# EAGLE board BlockBox v2 (EAGLE 9.5.2), part 1 of 2
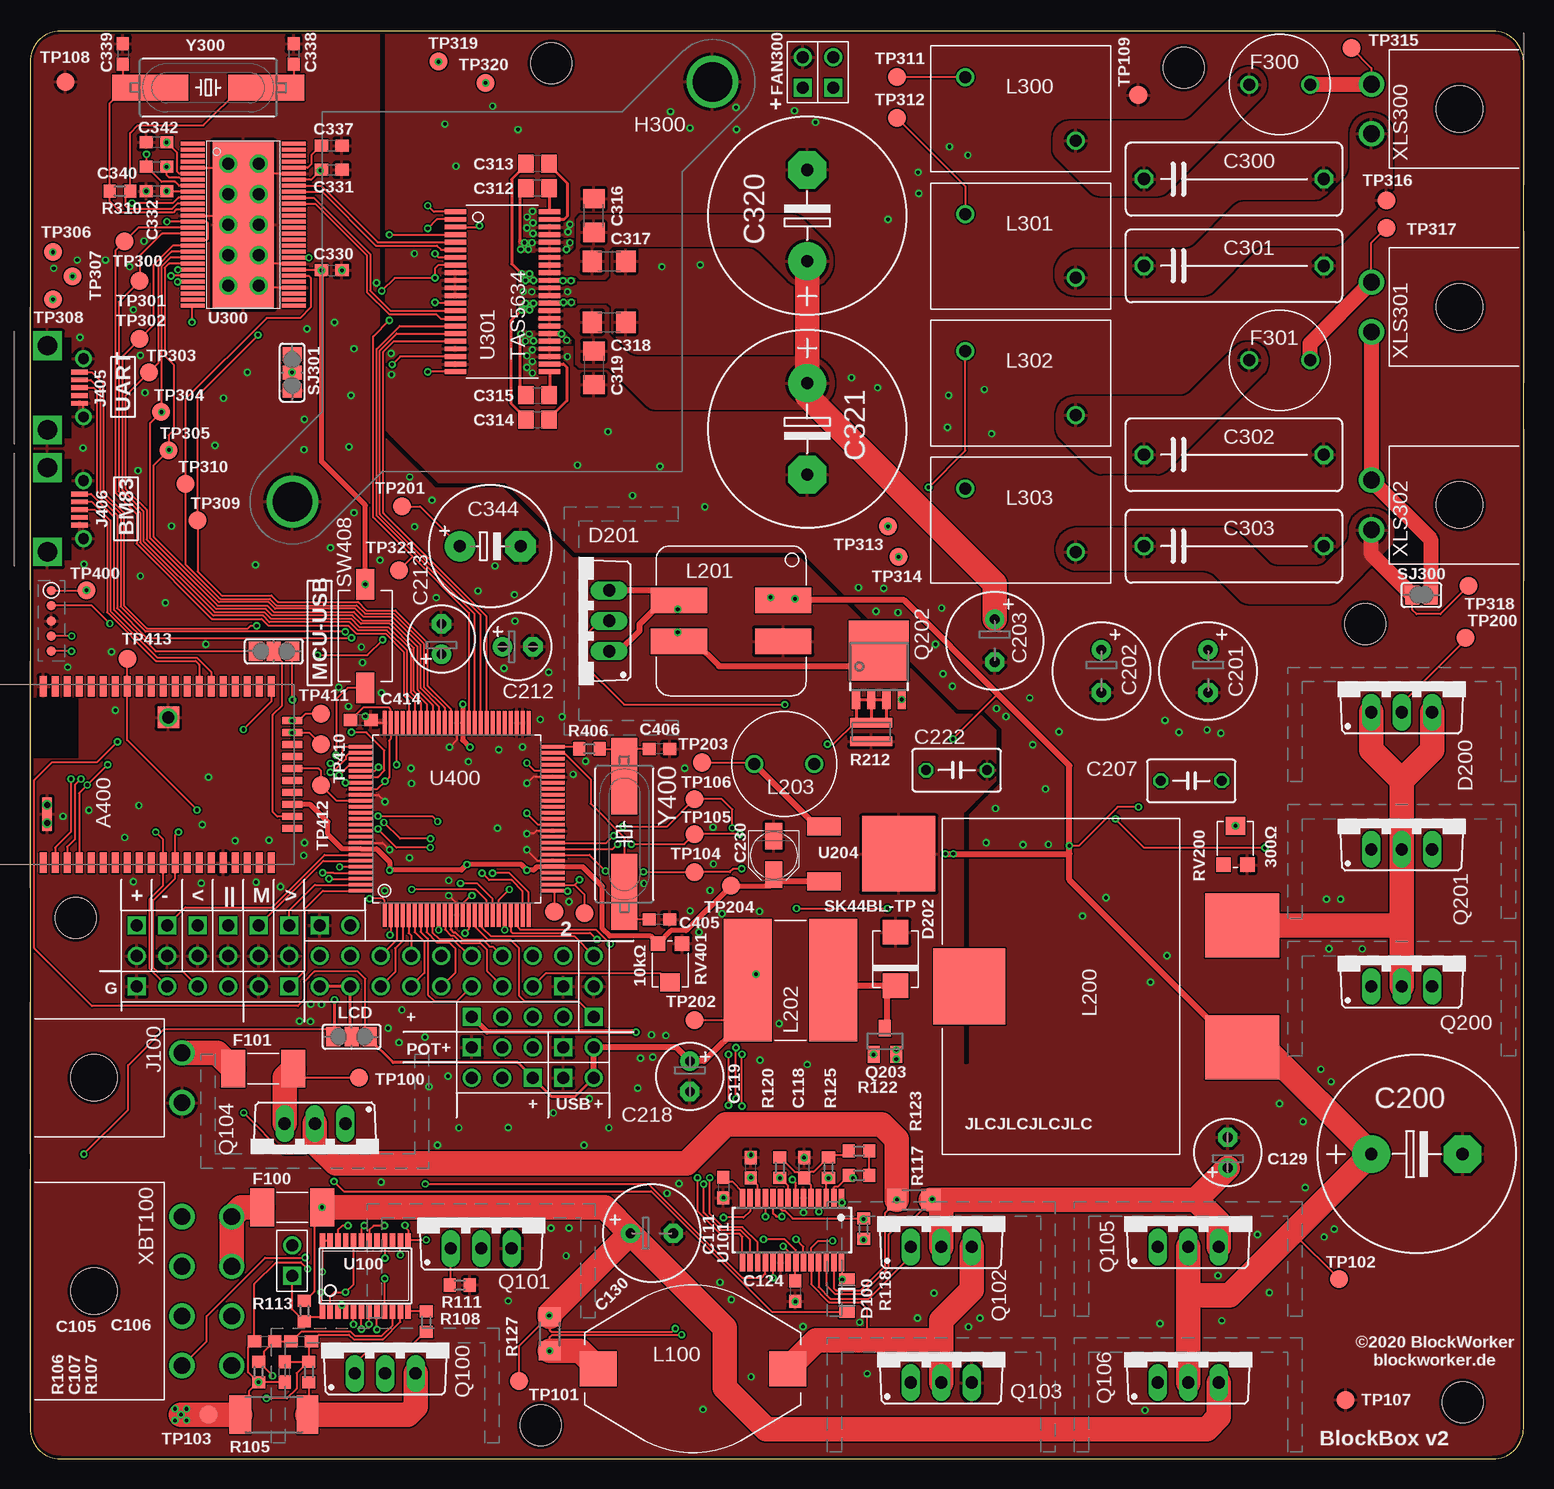
[diagram p4: board, top side]
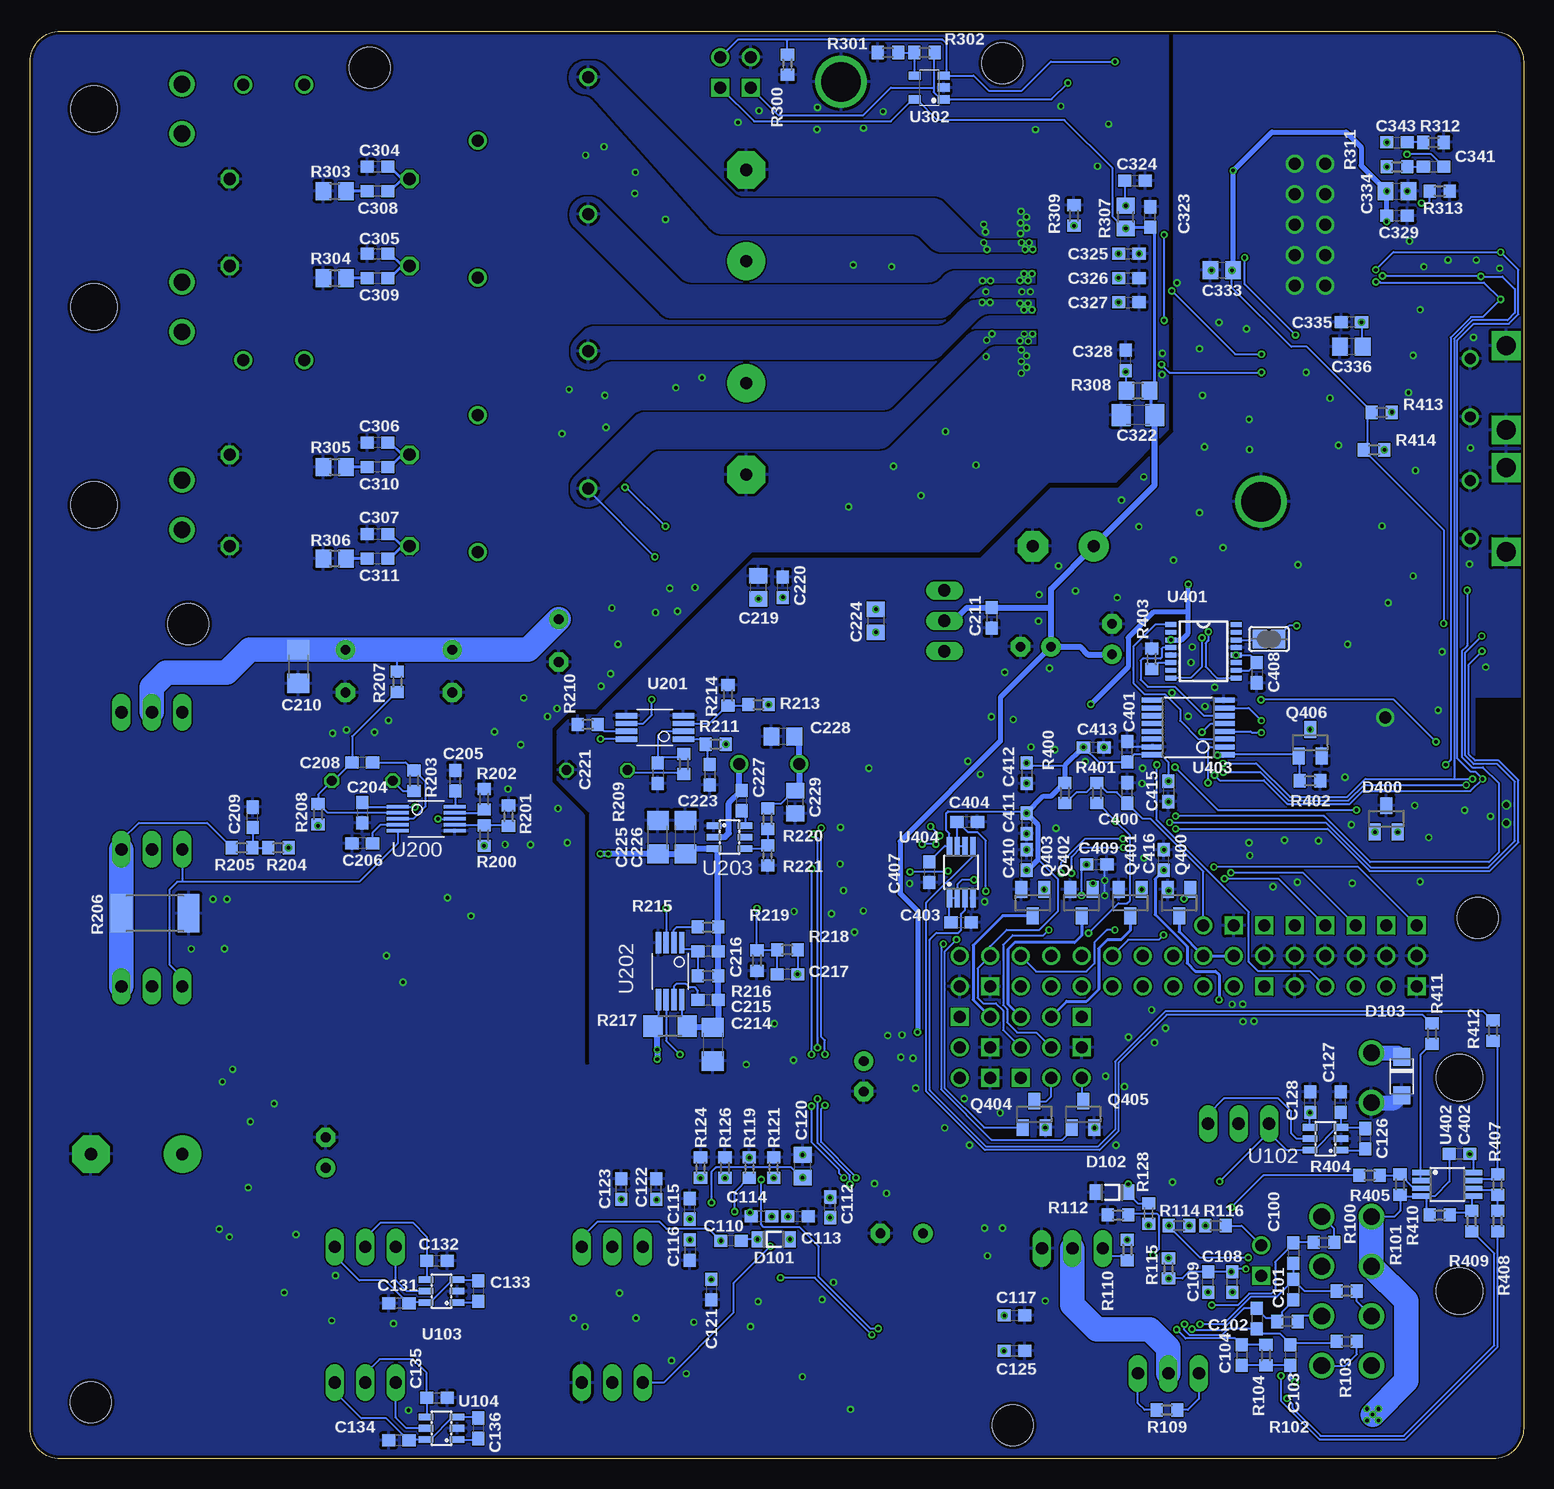
[diagram p5: board, bottom side, seen from below]

Size 124.46 x 119 mm. Coordinates in mm from the lower left corner, seen from the top.
Outline: 121.92,119 2.54,119 arc90 0,116.46 0,2.54 arc90 2.54,0 121.92,0 arc90 124.46,2.54 124.46,116.46 arc90 121.92,119
Copper layers (1*16): Top 0.035mm / dielectric 1.5mm / Bottom 0.035mm
Design rules "jlcpcb-2l": minimum track width 5mil, minimum drill 0.3mm, track to track 5mil, track to pad 5mil, pad to pad 5mil, via to via 5mil, smd to smd 0mil, copper to edge 0.25mm, drill to drill 6mil, minimum pad ring 6mil, minimum via ring 6mil, stop-mask expansion 4mil, vias tented up to drill 0.3mm, thermal gap 10mil
Holes 3.4 mm at 42.55,2.79 3.81,45.09 43.43,116.33 119.38,4.7 111.25,69.6 96.14,115.95

## Footprints (pad centres in the part's own frame; a part is rotated, then mirrored left to right if it is on the bottom)
BM83 = smd 1.7 x 0.6: 1 0.15,-1.1; 2 0.15,-2.1; 3 0.15,-3.1; 4 0.15,-4.1; 5 0.15,-5.1; 6 0.15,-6.1; 7 0.15,-7.1; 8 0.15,-8.1; 9 0.15,-9.1; 10 0.15,-10.1; 11 0.15,-11.1; 12 0.15,-12.1; 13 0.15,-13.1; 14 0.15,-14.1; 15 0.15,-15.1; 16 0.15,-16.1; 17 0.15,-17.1; 18 0.15,-18.1; 19 0.15,-19.1; 20 0.15,-20.1; 31 14.85,-20.1; 32 14.85,-19.1; 33 14.85,-18.1; 34 14.85,-17.1; 35 14.85,-16.1; 36 14.85,-15.1; 37 14.85,-14.1; 38 14.85,-13.1; 39 14.85,-12.1; 40 14.85,-11.1; 41 14.85,-10.1; 42 14.85,-9.1; 43 14.85,-8.1; 44 14.85,-7.1; 45 14.85,-6.1; 46 14.85,-5.1; 47 14.85,-4.1; 48 14.85,-3.1; 49 14.85,-2.1; 50 14.85,-1.1 | smd 0.6 x 1.7: 21 3,-21.85; 22 4,-21.85; 23 5,-21.85; 24 6,-21.85; 25 7,-21.85; 26 8,-21.85; 27 9,-21.85; 28 10,-21.85; 29 11,-21.85; 30 12,-21.85 | smd 2.79 x 0.76: G1 4.21,-1.42 | smd 1.78 x 1.78: G2 12.27,-11.53
C0603 = smd 1.1 x 1: 1 -0.85,0; 2 0.85,0
C0805 = smd 1.3 x 1.5: 1 -0.95,0; 2 0.95,0
E2,5-6 = drill 0.813 pad 1.6: + -1.27,0 | drill 0.813 pad 1.6 octagon: - 1.27,0
E3,5-8 = drill 0.813 pad 1.6: + -1.778,0 | drill 0.813 pad 1.6 octagon: - 1.778,0
E7,5-16 = drill 1.016 pad 3.15: + -3.81,0 | drill 1.016 pad 3.15 octagon: - 3.81,0
C050-035X075 = drill 0.813 octagon: 1 -2.54,0; 2 2.54,0
C1206 = smd 1.6 x 1.8: 1 -1.4,0; 2 1.4,0
PANASONIC_B = smd 2.2 x 1.4: + 1.6,0; - -1.6,0
C150-064X183 = drill 1.016 octagon: 1 -7.493,0; 2 7.493,0
E5-10,5 = drill 1.016 pad 2.54: + -2.54,0 | drill 1.016 pad 2.54 octagon: - 2.54,0
SOD323 = smd 1 x 1.3: 1 -1.35,0; 2 1.35,0
DO-219AB = smd 1.5 x 1.4: A -1.6,0; K 1.6,0
TO220ABS-HS1 = drill 1.016 long: A1 -2.54,-2.54; A2 2.54,-2.54; C 0,-2.54
DO-214AA = smd 2.032 x 2.108: A -2.235,0; K 2.235,0
SOT23 = smd 1 x 1.4: 1 -0.95,-1.1; 2 0.95,-1.1; 3 0,1.1
F2410 = smd 2 x 3.15: 1 -2.5,0; 2 2.5,0
MRF_FUSE = drill 1: 1 -2.54,0; 2 2.54,0
WIRE-2P-SIMPLE = drill 1 square: 1 -1.27,0 | drill 1: 2 1.27,0
ATS-CPX030030030-173-C2-R0 = drill 3.3: H1 17.5,17.5; H2 -17.5,-17.5
TE-770966 = drill 1.4: 1 -2.07,12.67; 2 2.07,12.67 | hole 3.86: 0,5.33
5P-1.27-POGO = smd 0.8 x 0.8: 1 -2.54,0; 2 -1.27,0; 3 0,0; 4 1.27,0; 5 2.54,0
4PIN = drill 1 square: 1 -3.81,0 | drill 1: 2 -1.27,0; 3 1.27,0; 4 3.81,0
3PIN = drill 1 square: 1 -2.54,0 | drill 1: 2 0,0; 3 2.54,0
2PIN = drill 1 square: 1 -1.27,0 | drill 1: 2 1.27,0
ZX62D-B-5PA8 = smd 0.4 x 1.35: 1 3.4,4.125; 2 4.05,4.125; 3 4.7,4.125; 4 5.35,4.125; 5 6,4.125 | drill 1.6 pad 2.375 square: S1 1.188,1.45; S2 8.213,1.45 | drill 0.9 pad 1.4: S3 2.275,4.45; S4 7.125,4.45
PM5022 = smd 3.1 x 2.9: 1 -7.9,0; 2 7.9,0
PQ2614B = smd 5.33 x 6.2: 1 -5.075,-14.66; 2 5.075,-14.66 | smd 6.35 x 6: M 0,8.08
SRF1280A = smd 2.15 x 4.7: 1 -1.715,4.35; 2 1.715,4.35; 3 1.715,-4.35; 4 -1.715,-4.35
SRN1060 = smd 4 x 10.2: 1 -3.55,0; 2 3.55,0
RLB0912 = drill 1: 1 -2.5,0; 2 2.5,0
1D14A = drill 1: 1 -4.6,2.65; 2 4.6,-2.65
TO220BV-HS1 = drill 1.016 long: D 0,-2.54; G -2.54,-2.54; S 2.54,-2.54
SOT669 = smd 0.7 x 1.6: 1 -1.905,-2.75; 2 -0.635,-2.75; 3 0.635,-2.75; 4 1.905,-2.75 | smd 5 x 5: MB 0,1.35
R0603 = smd 1 x 1.1: 1 -0.85,0; 2 0.85,0
R2512 = smd 1.8 x 3.2: 1 -2.8,0; 2 2.8,0
R1206 = smd 1.6 x 1.803: 1 -1.422,0; 2 1.422,0
R0612 = smd 0.8 x 3.5: 1 -0.78,0; 2 0.78,0
R0805 = smd 1.3 x 1.5: 1 -0.95,0; 2 0.95,0
TC33X-2 = smd 1.2 x 1.2: 1 -1,-1.8; 3 1,-1.8 | smd 1.6 x 1.5: 2 0,1.45
WIRE-3P-SIMPLE = drill 1 square: 1 -2.54,0 | drill 1: 2 0,0; 3 2.54,0
SJ = smd 1.168 x 1.6: 1 -0.762,0; 2 0.762,0
SJ_2 = smd 1.168 x 1.6: 1 -1.524,0; 2 0,0; 3 1.524,0
SDA01H1S = smd 1.524 x 2.54: 1 0,-4.318; 2 0,4.318
TP15R = smd 1.5 x 1.5: TP 0,0
TSSOP24 = smd 0.45 x 1.3: 1 -3.575,-2.918; 2 -2.925,-2.918; 3 -2.275,-2.918; 4 -1.625,-2.918; 5 -0.975,-2.918; 6 -0.325,-2.918; 7 0.325,-2.918; 8 0.975,-2.918; 9 1.625,-2.918; 10 2.275,-2.918; 11 2.925,-2.918; 12 3.575,-2.918; 13 3.575,2.918; 14 2.925,2.918; 15 2.275,2.918; 16 1.625,2.918; 17 0.975,2.918; 18 0.325,2.918; 19 -0.325,2.918; 20 -0.975,2.918; 21 -1.625,2.918; 22 -2.275,2.918; 23 -2.925,2.918; 24 -3.575,2.918
QSOP28 = smd 0.45 x 1.5: 1 -4.128,-2.69; 2 -3.493,-2.69; 3 -2.857,-2.69; 4 -2.223,-2.69; 5 -1.587,-2.69; 6 -0.953,-2.69; 7 -0.318,-2.69; 8 0.318,-2.69; 9 0.953,-2.69; 10 1.587,-2.69; 11 2.223,-2.69; 12 2.857,-2.69; 13 3.493,-2.69; 14 4.128,-2.69; 15 4.128,2.69; 16 3.493,2.69; 17 2.857,2.69; 18 2.223,2.69; 19 1.587,2.69; 20 0.953,2.69; 21 0.318,2.69; 22 -0.318,2.69; 23 -0.953,2.69; 24 -1.587,2.69; 25 -2.223,2.69; 26 -2.857,2.69; 27 -3.493,2.69; 28 -4.128,2.69
SOT23-6L = smd 0.55 x 1.2: 1 -0.95,-1.3; 2 0,-1.3; 3 0.95,-1.3; 4 0.95,1.3; 5 0,1.3; 6 -0.95,1.3
VSSOP10 = smd 1.8 x 0.3: 1 -2.375,1; 2 -2.375,0.5; 3 -2.375,0; 4 -2.375,-0.5; 5 -2.375,-1; 6 2.375,-1; 7 2.375,-0.5; 8 2.375,0; 9 2.375,0.5; 10 2.375,1
VSSOP8 = smd 1.8 x 0.45: 1 -2.375,0.975; 2 -2.375,0.325; 3 -2.375,-0.325; 4 -2.375,-0.975; 5 2.375,-0.975; 6 2.375,-0.325; 7 2.375,0.325; 8 2.375,0.975
DPAK = smd 1.5 x 2.8: 1 -2.286,-3.95; 3 2.286,-3.95 | smd 6.3 x 6.1: TAB 0,2.3
HTSSOP56DCA = smd 0.3 x 2: 1 -6.75,-4.2; 2 -6.25,-4.2; 3 -5.75,-4.2; 4 -5.25,-4.2; 5 -4.75,-4.2; 6 -4.25,-4.2; 7 -3.75,-4.2; 8 -3.25,-4.2; 9 -2.75,-4.2; 10 -2.25,-4.2; 11 -1.75,-4.2; 12 -1.25,-4.2; 13 -0.75,-4.2; 14 -0.25,-4.2; 15 0.25,-4.2; 16 0.75,-4.2; 17 1.25,-4.2; 18 1.75,-4.2; 19 2.25,-4.2; 20 2.75,-4.2; 21 3.25,-4.2; 22 3.75,-4.2; 23 4.25,-4.2; 24 4.75,-4.2; 25 5.25,-4.2; 26 5.75,-4.2; 27 6.25,-4.2; 28 6.75,-4.2; 29 6.75,4.2; 30 6.25,4.2; 31 5.75,4.2; 32 5.25,4.2; 33 4.75,4.2; 34 4.25,4.2; 35 3.75,4.2; 36 3.25,4.2; 37 2.75,4.2; 38 2.25,4.2; 39 1.75,4.2; 40 1.25,4.2; 41 0.75,4.2; 42 0.25,4.2; 43 -0.25,4.2; 44 -0.75,4.2; 45 -1.25,4.2; 46 -1.75,4.2; 47 -2.25,4.2; 48 -2.75,4.2; 49 -3.25,4.2; 50 -3.75,4.2; 51 -4.25,4.2; 52 -4.75,4.2; 53 -5.25,4.2; 54 -5.75,4.2; 55 -6.25,4.2; 56 -6.75,4.2 | smd 14 x 5.1: EXP 0,0
TSSOP44 = smd 1.8 x 0.4: 1 -3.925,6.668; 2 -3.925,6.032; 3 -3.925,5.397; 4 -3.925,4.763; 5 -3.925,4.128; 6 -3.925,3.493; 7 -3.925,2.857; 8 -3.925,2.223; 9 -3.925,1.587; 10 -3.925,0.953; 11 -3.925,0.318; 12 -3.925,-0.318; 13 -3.925,-0.953; 14 -3.925,-1.587; 15 -3.925,-2.223; 16 -3.925,-2.857; 17 -3.925,-3.493; 18 -3.925,-4.128; 19 -3.925,-4.763; 20 -3.925,-5.397; 21 -3.925,-6.032; 22 -3.925,-6.668; 23 3.925,-6.668; 24 3.925,-6.032; 25 3.925,-5.397; 26 3.925,-4.763; 27 3.925,-4.128; 28 3.925,-3.493; 29 3.925,-2.857; 30 3.925,-2.223; 31 3.925,-1.587; 32 3.925,-0.953; 33 3.925,-0.318; 34 3.925,0.318; 35 3.925,0.953; 36 3.925,1.587; 37 3.925,2.223; 38 3.925,2.857; 39 3.925,3.493; 40 3.925,4.128; 41 3.925,4.763; 42 3.925,5.397; 43 3.925,6.032; 44 3.925,6.668
TSOP-5 = smd 0.7 x 1: 1 -0.99,-1.2; 2 0,-1.2; 3 0.99,-1.2; 4 0.99,1.2; 5 -0.99,1.2
TQFP100-14X14X1MM = smd 2 x 0.3: 1 -8,6; 2 -8,5.5; 3 -8,5; 4 -8,4.5; 5 -8,4; 6 -8,3.5; 7 -8,3; 8 -8,2.5; 9 -8,2; 10 -8,1.5; 11 -8,1; 12 -8,0.5; 13 -8,0; 14 -8,-0.5; 15 -8,-1; 16 -8,-1.5; 17 -8,-2; 18 -8,-2.5; 19 -8,-3; 20 -8,-3.5; 21 -8,-4; 22 -8,-4.5; 23 -8,-5; 24 -8,-5.5; 25 -8,-6; 51 8,-6; 52 8,-5.5; 53 8,-5; 54 8,-4.5; 55 8,-4; 56 8,-3.5; 57 8,-3; 58 8,-2.5; 59 8,-2; 60 8,-1.5; 61 8,-1; 62 8,-0.5; 63 8,0; 64 8,0.5; 65 8,1; 66 8,1.5; 67 8,2; 68 8,2.5; 69 8,3; 70 8,3.5; 71 8,4; 72 8,4.5; 73 8,5; 74 8,5.5; 75 8,6 | smd 0.3 x 2: 26 -6,-8; 27 -5.5,-8; 28 -5,-8; 29 -4.5,-8; 30 -4,-8; 31 -3.5,-8; 32 -3,-8; 33 -2.5,-8; 34 -2,-8; 35 -1.5,-8; 36 -1,-8; 37 -0.5,-8; 38 0,-8; 39 0.5,-8; 40 1,-8; 41 1.5,-8; 42 2,-8; 43 2.5,-8; 44 3,-8; 45 3.5,-8; 46 4,-8; 47 4.5,-8; 48 5,-8; 49 5.5,-8; 50 6,-8; 76 6,8; 77 5.5,8; 78 5,8; 79 4.5,8; 80 4,8; 81 3.5,8; 82 3,8; 83 2.5,8; 84 2,8; 85 1.5,8; 86 1,8; 87 0.5,8; 88 0,8; 89 -0.5,8; 90 -1,8; 91 -1.5,8; 92 -2,8; 93 -2.5,8; 94 -3,8; 95 -3.5,8; 96 -4,8; 97 -4.5,8; 98 -5,8; 99 -5.5,8; 100 -6,8
SSOP16 = smd 0.914 x 0.406: 1 -2.718,2.223; 2 -2.718,1.587; 3 -2.718,0.953; 4 -2.718,0.318; 5 -2.718,-0.318; 6 -2.718,-0.953; 7 -2.718,-1.587; 8 -2.718,-2.223; 9 2.718,-2.223; 10 2.718,-1.587; 11 2.718,-0.953; 12 2.718,-0.318; 13 2.718,0.318; 14 2.718,0.953; 15 2.718,1.587; 16 2.718,2.223
MSOP8 = smd 0.45 x 1.45: 1 -0.975,-2.2; 2 -0.325,-2.2; 3 0.325,-2.2; 4 0.975,-2.2; 5 0.975,2.2; 6 0.325,2.2; 7 -0.325,2.2; 8 -0.975,2.2
TSSOP16L = smd 0.42 x 1.78: 1 -2.275,-2.97; 2 -1.625,-2.97; 3 -0.975,-2.97; 4 -0.325,-2.97; 5 0.325,-2.97; 6 0.975,-2.97; 7 1.625,-2.97; 8 2.275,-2.97; 9 2.275,2.97; 10 1.625,2.97; 11 0.975,2.97; 12 0.325,2.97; 13 -0.325,2.97; 14 -0.975,2.97; 15 -1.625,2.97; 16 -2.275,2.97
TE-770970 = drill 1.4: 1 -6.21,16.81; 2 -2.07,16.81; 3 2.07,16.81; 4 6.21,16.81; 5 -6.21,12.67; 6 -2.07,12.67; 7 2.07,12.67; 8 6.21,12.67 | hole 3.86: 0,5.33
2X9PIN = drill 1 square: 1 -8.89,1.27 | drill 1: 2 -8.89,-1.27; 3 -6.35,1.27; 4 -6.35,-1.27; 5 -3.81,1.27; 6 -3.81,-1.27; 7 -1.27,1.27; 8 -1.27,-1.27; 9 1.27,1.27; 10 1.27,-1.27; 11 3.81,1.27; 12 3.81,-1.27; 13 6.35,1.27; 14 6.35,-1.27; 15 8.89,1.27; 16 8.89,-1.27; 17 11.43,1.27; 18 11.43,-1.27
HC49US = smd 6.35 x 2.159: 1 -4.826,0; 2 4.826,0

## Placement (x,y rotation side)
A400  BM83  [BM83]  0,49.53 90 top
C100  1µF  [C0603]  19.18,17.14 270 bottom
C101  1µF  [C0603]  19.18,14.1 270 bottom
C102  1µF  [C0603]  22.23,11.68 270 bottom
C103  1µF  [C0603]  19.43,8.64 270 bottom
C104  1µF  [C0603]  23.5,8.64 270 bottom
C105  0.1µF  [C0603]  19.56,9.78 0 top
C106  0.1µF  [C0603]  22.61,9.78 0 top
C107  0.1µF  [C0603]  21.21,7.24 90 top
C108  1µF  [C0603]  24.26,14.73 90 bottom
C109  1µF  [C0603]  26.29,14.73 90 bottom
C110  0.1µF  [C0603]  66.04,18.16 180 bottom
C111  4.7nF  [C0603]  57.78,22.61 270 top
C112  4.7nF  [C0603]  57.78,20.95 90 bottom
C113  47nF  [C0603]  60.45,20.19 0 bottom
C114  47nF  [C0603]  63.5,20.19 180 bottom
C115  1nF  [C0603]  69.47,20.83 90 bottom
C116  0.1µF  [C0603]  69.47,17.4 270 bottom
C117  0.1µF  [C0603]  42.42,11.94 0 bottom
C118  1µF  [C0603]  64.52,24.26 90 top
C119  0.1µF  [C0603]  60.07,24.26 90 top
C120  4.7µF  [C0805]  60.07,24.38 90 bottom
C121  0.1µF  [C0603]  67.69,14.1 270 bottom
C122  0.1µF  [C0603]  72.26,22.48 90 bottom
C123  0.1µF  [C0603]  75.18,22.48 90 bottom
C124  0.1µF  [C0603]  63.75,13.97 270 top
C125  0.1µF  [C0603]  42.42,9.02 0 bottom
C126  0.1µF  [C0603]  13.21,26.67 270 bottom
C127  0.1µF  [C0603]  15.24,29.72 90 bottom
C128  0.1µF  [C0603]  17.78,29.72 90 bottom
C129  47µF  [E2,5-6]  99.82,25.53 90 top
C130  220µF  [E3,5-8]  51.82,18.8 0 top
C131  0.1µF  [C0603]  93.73,12.95 180 bottom
C132  0.1µF  [C0603]  90.55,16.51 0 bottom
C133  0.1µF  [C0603]  87.12,13.97 270 bottom
C134  0.1µF  [C0603]  93.73,1.52 180 bottom
C135  0.1µF  [C0603]  90.55,5.08 0 bottom
C136  0.1µF  [C0603]  87.12,2.54 270 bottom
C200  1mF 50V  [E7,5-16]  115.57,25.4 0 top
C201  33µF  [E3,5-8]  98.17,65.66 270 top
C202  33µF  [E3,5-8]  89.28,65.66 270 top
C203  33µF  [E3,5-8]  80.39,68.2 270 top
C204  0.1µF  [C0603]  96.77,53.85 270 bottom
C205  8.2nF  [C0603]  89.03,56.52 90 bottom
C206  0.1µF  [C0603]  96.77,51.31 180 bottom
C207  0.47µF  [C050-035X075]  96.77,56.52 0 top
C208  10nF C0G  [C0603]  96.77,58.04 180 bottom
C209  1nF  [C0603]  105.92,53.47 90 bottom
C210  1µF 100V  [C1206]  102.11,66.04 270 bottom
C211  0.1µF  [C0603]  44.32,70.1 270 bottom
C212  47µF  [E2,5-6]  40.64,67.69 0 top
C213  47µF  [E2,5-6]  34.29,68.33 90 top
C214  10µF 35V  [C1206]  67.56,34.54 270 bottom
C215  0.47µF  [C0603]  67.94,38.23 180 bottom
C216  1nF  [C0603]  67.94,42.29 180 bottom
C217  1nF  [C0603]  61.34,40.39 180 bottom
C218  47µF  [E2,5-6]  54.99,31.88 270 top
C219  4.7µF  [C0805]  63.75,72.64 90 bottom
C220  0.1µF  [C0603]  61.72,72.64 90 bottom
C221  12nF  [C0603]  72.14,57.15 270 bottom
C222  0.33µF  [C050-035X075]  77.22,57.4 0 top
C223  910pF  [C0603]  67.82,57.02 270 bottom
C224  4.7µF  [C0805]  53.98,69.85 270 bottom
C225  10µF 35V  [C1206]  72.14,51.82 90 bottom
C226  10µF 35V  [C1206]  69.85,51.82 90 bottom
C227  0.1µF  [C0603]  65.15,54.86 90 bottom
C228  22µF  [C0805]  61.72,60.2 180 bottom
C229  22µF  [C0805]  60.71,54.74 270 bottom
C230  2.2µF  [PANASONIC_B]  61.98,50.29 270 top
C300  0.68µF  [C150-064X183]  100.33,106.68 0 top
C301  0.68µF  [C150-064X183]  100.33,99.44 0 top
C302  0.68µF  [C150-064X183]  100.33,83.69 0 top
C303  0.68µF  [C150-064X183]  100.33,76.07 0 top
C304  1nF 100V  [C0603]  95.5,107.7 180 bottom
C305  1nF 100V  [C0603]  95.5,100.46 0 bottom
C306  1nF 100V  [C0603]  95.5,84.71 180 bottom
C307  1nF 100V  [C0603]  95.5,77.09 0 bottom
C308  10nF 100V  [C0603]  95.5,105.66 180 bottom
C309  10nF 100V  [C0603]  95.5,98.42 0 bottom
C310  10nF 100V  [C0603]  95.5,82.68 180 bottom
C311  10nF 100V  [C0603]  95.5,75.06 0 bottom
C312  33nF  [C0805]  42.29,105.92 180 top
C313  33nF  [C0805]  42.29,107.95 180 top
C314  33nF  [C0805]  42.29,86.61 0 top
C315  33nF  [C0805]  42.29,88.65 0 top
C316  1µF 100V  [C1206]  46.99,103.63 90 top
C317  1µF 100V  [C1206]  48.26,99.82 0 top
C318  1µF 100V  [C1206]  48.26,94.74 0 top
C319  1µF 100V  [C1206]  46.99,90.93 270 top
C320  1mF 80V  [E7,5-16]  64.77,103.63 90 top
C321  1mF 80V  [E7,5-16]  64.77,85.85 270 top
C322  10µF 35V  [C1206]  32.13,87 180 bottom
C323  0.1µF  [C0603]  31.11,103.5 90 bottom
C324  0.1µF  [C0603]  32.38,106.55 0 bottom
C325  0.33µF  [C0603]  32.89,100.46 0 bottom
C326  1µF  [C0603]  32.89,98.42 0 bottom
C327  1µF  [C0603]  32.89,96.39 0 bottom
C328  0.1µF  [C0603]  33.15,91.57 90 bottom
C329  0.1µF  [C0603]  10.54,103.63 0 bottom
C330  0.1µF  [C0603]  25.15,99.06 0 top
C331  0.1µF  [C0603]  25.15,107.44 0 top
C332  0.1µF  [C0603]  10.54,105.66 180 top
C333  10µF  [C0805]  25.15,99.06 180 bottom
C334  10µF  [C0805]  10.54,105.66 0 bottom
C335  0.1µF  [C0603]  14.35,94.74 180 bottom
C336  10µF  [C0805]  14.35,92.71 180 bottom
C337  0.1µF  [C0603]  25.15,109.47 0 top
C338  18pF  [C0603]  21.97,117.09 270 top
C339  18pF  [C0603]  7.75,117.09 270 top
C340  4.7nF  [C0603]  10.54,107.7 0 top
C341  47nF  [C0603]  7.49,107.7 180 bottom
C342  4.7nF  [C0603]  10.54,109.73 180 top
C343  47nF  [C0603]  10.54,109.73 0 bottom
C344  1mF 16V  [E5-10,5]  38.35,76.07 0 top
C400  0.1µF  [C0603]  33.02,55.5 90 bottom
C401  0.1µF  [C0603]  33.02,58.93 90 bottom
C402  0.1µF  [C0603]  5.33,25.4 180 bottom
C403  0.1µF  [C0603]  46.86,44.7 0 bottom
C404  0.1µF  [C0603]  46.35,53.09 0 bottom
C405  18pF  [C0603]  52.45,44.96 180 top
C406  18pF  [C0603]  52.45,59.18 180 top
C407  0.1µF  [C0603]  49.53,48.9 270 bottom
C408  0.1µF  [C0603]  22.23,65.53 270 bottom
C409  0.1µF  [C0603]  35.56,49.53 0 bottom
C410  0.1µF  [C0603]  41.4,49.91 90 bottom
C411  0.1µF  [C0603]  41.4,52.96 270 bottom
C412  0.1µF  [C0603]  41.4,57.15 270 bottom
C413  0.1µF  [C0603]  35.81,59.31 0 bottom
C414  0.1µF  [C0603]  27.56,61.59 0 top
C415  0.1µF  [C0603]  29.59,55.63 270 bottom
C416  0.1µF  [C0603]  29.97,49.91 90 bottom
D100  NSR0530H  [SOD323]  68.07,13.59 270 top
D101  NSR0530H  [SOD323]  62.48,18.29 0 bottom
D102  3.9V  [SOD323]  34.29,22.23 180 bottom
D103  SMF28A-M3  [DO-219AB]  10.16,31.88 90 bottom
D200  STPS20M100ST  [TO220ABS-HS1]  114.3,64.77 0 top
D201  RB085T-60HZC9  [TO220ABS-HS1]  45.72,69.85 90 top
D202  SK44BL-TP  [DO-214AA]  72.14,41.66 270 top
D400  D5V0L2B3SO  [SOT23]  11.43,53.34 0 bottom
F100  15A  [F2410]  21.84,20.95 0 top
F101  10A  [F2410]  19.43,32.51 0 top
F300  2A  [MRF_FUSE]  104.14,114.55 0 top
F301  1.25A  [MRF_FUSE]  104.14,91.57 0 top
FAN300  12V <50mA  [WIRE-2P-SIMPLE]  64.39,115.57 90 top
H300  ATS-CPX030030030-173-C2-R0  [ATS-CPX030030030-173-C2-R0]  39.37,97.28 0 top
J100  TE-770966  [TE-770966]  0,31.75 270 top
J400  ICSP  [5P-1.27-POGO]  1.78,69.85 270 top
J401  LED  [4PIN]  40.64,36.83 0 top
J402  SWLED  [3PIN]  39.37,31.75 180 top
J403  USB1  [2PIN]  45.72,31.75 0 top
J404  USB2  [2PIN]  45.72,34.29 0 top
J405  ZX62D-B-5PA8  [ZX62D-B-5PA8]  0,93.98 270 top
J406  ZX62D-B-5PA8  [ZX62D-B-5PA8]  0,83.82 270 top
J408  AUX  [4PIN]  12.7,39.37 0 top
L100  10µH  [PM5022]  55.24,7.49 180 top
L200  10µH  [PQ2614B]  86.36,39.37 90 top
L201  22/88µF  [SRF1280A]  58.42,69.85 270 top
L202  10µH  [SRN1060]  63.37,39.88 180 top
L203  10µH  [RLB0912]  62.87,57.91 180 top
L300  15µH  [1D14A]  82.55,112.52 0 top
L301  15µH  [1D14A]  82.55,101.09 0 top
L302  15µH  [1D14A]  82.55,89.66 0 top
L303  15µH  [1D14A]  82.55,78.23 0 top
Q100  TK3R1E04PL  [TO220BV-HS1]  29.59,9.65 0 top
Q101  TK3R1E04PL  [TO220BV-HS1]  37.59,20.07 0 top
Q102  IPP052N06L3 G  [TO220BV-HS1]  75.95,20.19 0 top
Q103  IPP052N06L3 G  [TO220BV-HS1]  75.95,8.89 0 top
Q104  IPP052N06L3 G  [TO220BV-HS1]  23.75,25.4 180 top
Q105  IPP052N06L3 G  [TO220BV-HS1]  96.52,20.19 0 top
Q106  TK3R1E04PL  [TO220BV-HS1]  96.52,8.89 0 top
Q200  SUP90142E-GE3  [TO220BV-HS1]  114.3,41.91 0 top
Q201  SUP90142E-GE3  [TO220BV-HS1]  114.3,53.34 0 top
Q202  BUK9Y43-60E  [SOT669]  70.74,66.04 0 top
Q203  DMP4065S  [SOT23]  71.25,34.8 0 top
Q400  DMG2302UK  [SOT23]  28.7,46.35 180 bottom
Q401  DMG2302UK  [SOT23]  32.77,46.35 180 bottom
Q402  DMG2302UK  [SOT23]  36.83,46.35 180 bottom
Q403  DMG2302UK  [SOT23]  40.89,46.35 180 bottom
Q404  NMOS  [SOT23]  40.77,28.7 0 bottom
Q405  NMOS  [SOT23]  36.7,28.7 0 bottom
Q406  NMOS  [SOT23]  17.78,59.69 0 bottom
R100  33Ω  [R0603]  16.64,18.03 180 bottom
R101  33Ω  [R0603]  14.73,13.97 180 bottom
R102  33Ω  [R0603]  19.68,11.43 180 bottom
R103  33Ω  [R0603]  14.73,9.78 180 bottom
R104  33Ω  [R0603]  21.46,8.64 90 bottom
R105  2mΩ  [R2512]  20.32,3.68 0 top
R106  100Ω  [R0603]  19.05,7.24 90 top
R107  100Ω  [R0603]  23.24,7.24 90 top
R108  4.53kΩ  [R0603]  33.02,11.43 90 top
R109  1MΩ  [R0603]  29.72,4.06 0 bottom
R110  1kΩ  [R0603]  33.02,17.4 90 bottom
R111  1MΩ  [R0603]  35.81,14.48 180 top
R112  470kΩ  [R0603]  33.78,20.32 0 bottom
R113  1kΩ  [R0603]  22.86,12.32 90 top
R114  10kΩ  [R0603]  28.7,19.43 180 bottom
R115  10kΩ  [R0603]  29.59,15.88 270 bottom
R116  10kΩ  [R0603]  25.65,19.43 0 bottom
R117  5mΩ  [R1206]  73.66,21.59 180 top
R118  10kΩ  [R0603]  69.47,19.18 90 top
R119  10kΩ  [R0603]  64.52,24.26 270 bottom
R120  100kΩ  [R0603]  62.48,24.26 90 top
R121  100kΩ  [R0603]  62.48,24.26 270 bottom
R122  20kΩ  [R0603]  69.09,25.65 180 top
R123  30kΩ  [R0603]  69.09,23.62 0 top
R124  30kΩ  [R0603]  68.58,24.26 270 bottom
R125  30kΩ  [R0603]  66.55,24.26 90 top
R126  10kΩ  [R0603]  66.55,24.26 270 bottom
R127  10mΩ  [R1206]  43.31,10.41 90 top
R128  10kΩ  [R0603]  31.24,20.45 90 bottom
R200  10kΩ  [R0603]  86.61,51.94 270 bottom
R201  1.69kΩ  [R0603]  84.58,53.59 270 bottom
R202  86.6kΩ  [R0603]  86.61,54.99 270 bottom
R203  196Ω  [R0603]  92.46,56.52 270 bottom
R204  3.57kΩ  [R0603]  103.76,50.93 180 bottom
R205  100Ω  [R0603]  106.81,50.93 180 bottom
R206  6mΩ  [R2512]  114.05,45.47 180 bottom
R207  22kΩ  [R0603]  93.85,64.77 90 bottom
R208  487Ω  [R0603]  100.46,53.72 90 bottom
R209  324Ω  [R0603]  69.98,57.91 90 bottom
R210  48.7kΩ  [R0603]  77.98,61.21 180 bottom
R211  100Ω  [R0603]  67.31,59.56 0 bottom
R212  15mΩ  [R0612]  70.1,60.58 90 top
R213  84.5kΩ  [R0603]  63.75,62.87 0 bottom
R214  10kΩ  [R0603]  66.29,63.63 270 bottom
R215  44.2kΩ  [R0603]  67.94,44.32 0 bottom
R216  1.43kΩ  [R0603]  67.94,40.26 0 bottom
R217  10mΩ  [R1206]  71.12,36.07 0 bottom
R218  10kΩ  [R0603]  61.34,42.42 0 bottom
R219  3.32kΩ  [R0603]  63.88,41.53 90 bottom
R220  100kΩ  [R0603]  62.99,53.34 90 bottom
R221  20kΩ  [R0603]  62.99,50.29 90 bottom
R300  510Ω  [R0603]  61.34,116.2 90 bottom
R301  10kΩ  [R0603]  52.96,117.22 180 bottom
R302  39kΩ  [R0603]  49.91,117.22 0 bottom
R303  3.3Ω  [R0805]  99.06,105.66 0 bottom
R304  3.3Ω  [R0805]  99.06,98.42 0 bottom
R305  3.3Ω  [R0805]  99.06,82.68 0 bottom
R306  3.3Ω  [R0805]  99.06,75.06 0 bottom
R307  3.3Ω  [R0805]  33.15,103.5 90 bottom
R308  3.3Ω  [R0805]  32.13,89.03 180 bottom
R309  62kΩ  [R0603]  37.47,103.63 270 bottom
R310  1MΩ  [R0603]  7.49,105.66 0 top
R311  470Ω  [R0603]  10.54,107.7 180 bottom
R312  470Ω  [R0603]  7.49,109.73 0 bottom
R313  10kΩ  [R0603]  6.99,105.66 180 bottom
R400  10kΩ  [R0603]  38.23,55.5 90 bottom
R401  1kΩ  [R0603]  35.56,55.5 270 bottom
R402  10kΩ  [R0603]  17.78,56.52 180 bottom
R403  10kΩ  [R0603]  30.99,66.67 270 bottom
R404  10kΩ  [R0603]  12.83,23.62 180 bottom
R405  1.69kΩ  [R0603]  10.29,22.86 90 bottom
R406  1kΩ  [R0603]  46.61,59.18 180 top
R407  110kΩ 0.1%  [R0603]  2.16,22.86 270 bottom
R408  1kΩ 0.1%  [R0603]  2.16,19.81 270 bottom
R409  1kΩ 0.1%  [R0603]  4.32,19.81 270 bottom
R410  110kΩ 0.1%  [R0603]  6.99,20.32 0 bottom
R411  10kΩ  [R0603]  7.62,35.43 90 bottom
R412  10kΩ  [R0603]  2.54,35.69 270 bottom
R413  1kΩ  [R0603]  11.81,87.22 180 bottom
R414  1kΩ  [R0603]  12.45,84.1 180 bottom
RT300  103AT  [WIRE-2P-SIMPLE]  66.93,115.57 90 top
RV200  300Ω  [TC33X-2]  100.46,51.31 0 top
RV400  100kΩ  [WIRE-3P-SIMPLE]  39.37,34.29 0 top
RV401  10kΩ  [TC33X-2]  53.34,41.15 180 top
SJ300  BYPASS  [SJ]  115.95,72.01 0 top
SJ301  AD/BD  [SJ_2]  21.84,90.55 270 top
SJ400  USB-5V  [SJ_2]  20.32,67.31 0 top
SJ401  3.3V-5V  [SJ_2]  26.8,35.18 0 top
SJ402  VBUS  [SJ]  21.21,68.33 180 bottom
SW100  PWRSW  [WIRE-2P-SIMPLE]  21.84,16.51 90 top
SW400  VOL-  [WIRE-2P-SIMPLE]  11.43,43.18 270 top
SW401  MFB  [WIRE-2P-SIMPLE]  19.05,43.18 270 top
SW402  VOL+  [WIRE-2P-SIMPLE]  8.89,43.18 270 top
SW403  BACK  [WIRE-2P-SIMPLE]  13.97,43.18 270 top
SW404  PLAY  [WIRE-2P-SIMPLE]  16.51,43.18 270 top
SW405  FWD  [WIRE-2P-SIMPLE]  21.59,43.18 270 top
SW406  LCD_BL  [WIRE-2P-SIMPLE]  20.32,39.37 180 top
SW407  LEDMODE  [WIRE-3P-SIMPLE]  46.99,39.37 90 top
SW408  SDA01H1S  [SDA01H1S]  27.94,68.58 0 top
SW409  RESET  [WIRE-2P-SIMPLE]  25.4,44.45 0 top
TP100  TPTP15R  [TP15R]  27.43,31.75 0 top
TP101  TPTP15R  [TP15R]  40.77,6.48 0 top
TP102  TPTP15R  [TP15R]  109.09,14.99 0 top
TP103  TPTP15R  [TP15R]  14.86,3.68 0 top
TP104  TPTP15R  [TP15R]  55.37,48.9 0 top
TP105  TPTP15R  [TP15R]  55.37,52.07 0 top
TP106  TPTP15R  [TP15R]  55.37,54.99 0 top
TP107  TPTP15R  [TP15R]  109.63,4.9 0 top
TP108  TPTP15R  [TP15R]  2.95,114.78 0 top
TP109  TPTP15R  [TP15R]  92.35,113.67 0 top
TP200  TPTP15R  [TP15R]  119.63,68.45 0 top
TP201  TPTP15R  [TP15R]  30.99,79.38 0 top
TP202  TPTP15R  [TP15R]  55.37,36.58 0 top
TP203  TPTP15R  [TP15R]  56.01,58.04 0 top
TP204  TPTP15R  [TP15R]  58.42,47.75 0 top
TP300  TPTP15R  [TP15R]  7.87,101.47 0 top
TP301  TPTP15R  [TP15R]  9.14,98.17 0 top
TP302  TPTP15R  [TP15R]  9.14,93.34 0 top
TP303  TPTP15R  [TP15R]  9.91,90.55 0 top
TP304  TPTP15R  [TP15R]  10.92,87.25 0 top
TP305  TPTP15R  [TP15R]  11.56,84.07 0 top
TP306  TPTP15R  [TP15R]  1.91,100.58 0 top
TP307  TPTP15R  [TP15R]  3.56,98.55 0 top
TP308  TPTP15R  [TP15R]  1.91,96.65 0 top
TP309  TPTP15R  [TP15R]  13.97,78.23 0 top
TP310  TPTP15R  [TP15R]  12.95,81.28 0 top
TP311  TPTP15R  [TP15R]  72.26,115.19 0 top
TP312  TPTP15R  [TP15R]  72.26,111.76 0 top
TP313  TPTP15R  [TP15R]  71.5,77.72 0 top
TP314  TPTP15R  [TP15R]  72.39,75.18 0 top
TP315  TPTP15R  [TP15R]  110.11,117.6 0 top
TP316  TPTP15R  [TP15R]  113.03,104.9 0 top
TP317  TPTP15R  [TP15R]  113.03,102.62 0 top
TP318  TPTP15R  [TP15R]  119.89,72.77 0 top
TP319  TPTP15R  [TP15R]  34.04,116.46 0 top
TP320  TPTP15R  [TP15R]  37.97,114.68 0 top
TP321  TPTP15R  [TP15R]  30.73,74.04 0 top
TP400  TPTP15R  [TP15R]  4.7,72.39 0 top
TP408  TPTP15R  [TP15R]  43.69,45.59 0 top
TP409  TPTP15R  [TP15R]  46.23,45.47 0 top
TP410  TPTP15R  [TP15R]  24.26,59.56 90 top
TP411  TPTP15R  [TP15R]  24.26,62.1 90 top
TP412  TPTP15R  [TP15R]  24.26,56.13 90 top
TP413  TPTP15R  [TP15R]  8.13,66.67 90 top
U100  BQ77915  [TSSOP24]  27.94,15.24 0 top
U101  MAX1737  [QSOP28]  63.5,19.05 180 top
U102  LM74700-Q1  [SOT23-6L]  16.51,26.67 90 bottom
U103  LM74700-Q1  [SOT23-6L]  90.17,13.97 90 bottom
U104  LM74700-Q1  [SOT23-6L]  90.17,2.54 90 bottom
U200  LM5022  [VSSOP10]  91.44,53.34 0 bottom
U201  LM3488  [VSSOP8]  72.39,60.96 180 bottom
U202  LM25085  [VSSOP8]  71.12,40.64 270 bottom
U203  TPS54308  [SOT23-6L]  66.17,51.82 270 bottom
U204  LD39150DT33  [DPAK]  70.1,50.42 270 top
U300  TAS5548  [HTSSOP56DCA]  17.78,102.87 270 top
U301  TAS5634  [TSSOP44]  39.37,97.28 0 top
U302  NCS20071  [TSOP-5]  49.53,114.3 90 bottom
U400  PIC32MZ-EF-100  [TQFP100-14X14X1MM]  35.56,53.34 90 top
U401  FT230XS  [SSOP16]  26.67,67.31 0 bottom
U402  NCS2333  [MSOP8]  6.35,22.86 270 bottom
U403  FSAL200MTC  [TSSOP16L]  27.94,60.96 90 bottom
U404  NCS2333  [MSOP8]  46.86,48.9 0 bottom
XBT100  4S4P Li-ion + 103AT  [TE-770970]  0,13.97 270 top
XDS400  NHD-3.5-320240FT-CON  [2X9PIN]  35.56,40.64 180 top
XLS300  WOOFER  [TE-770966]  124.46,112.52 90 top
XLS301  TWEETER1  [TE-770966]  124.46,96.01 90 top
XLS302  TWEETER2  [TE-770966]  124.46,79.5 90 top
Y300  12.288MHz  [HC49US]  14.86,114.3 0 top
Y400  12MHz  [HC49US]  49.53,52.07 270 top